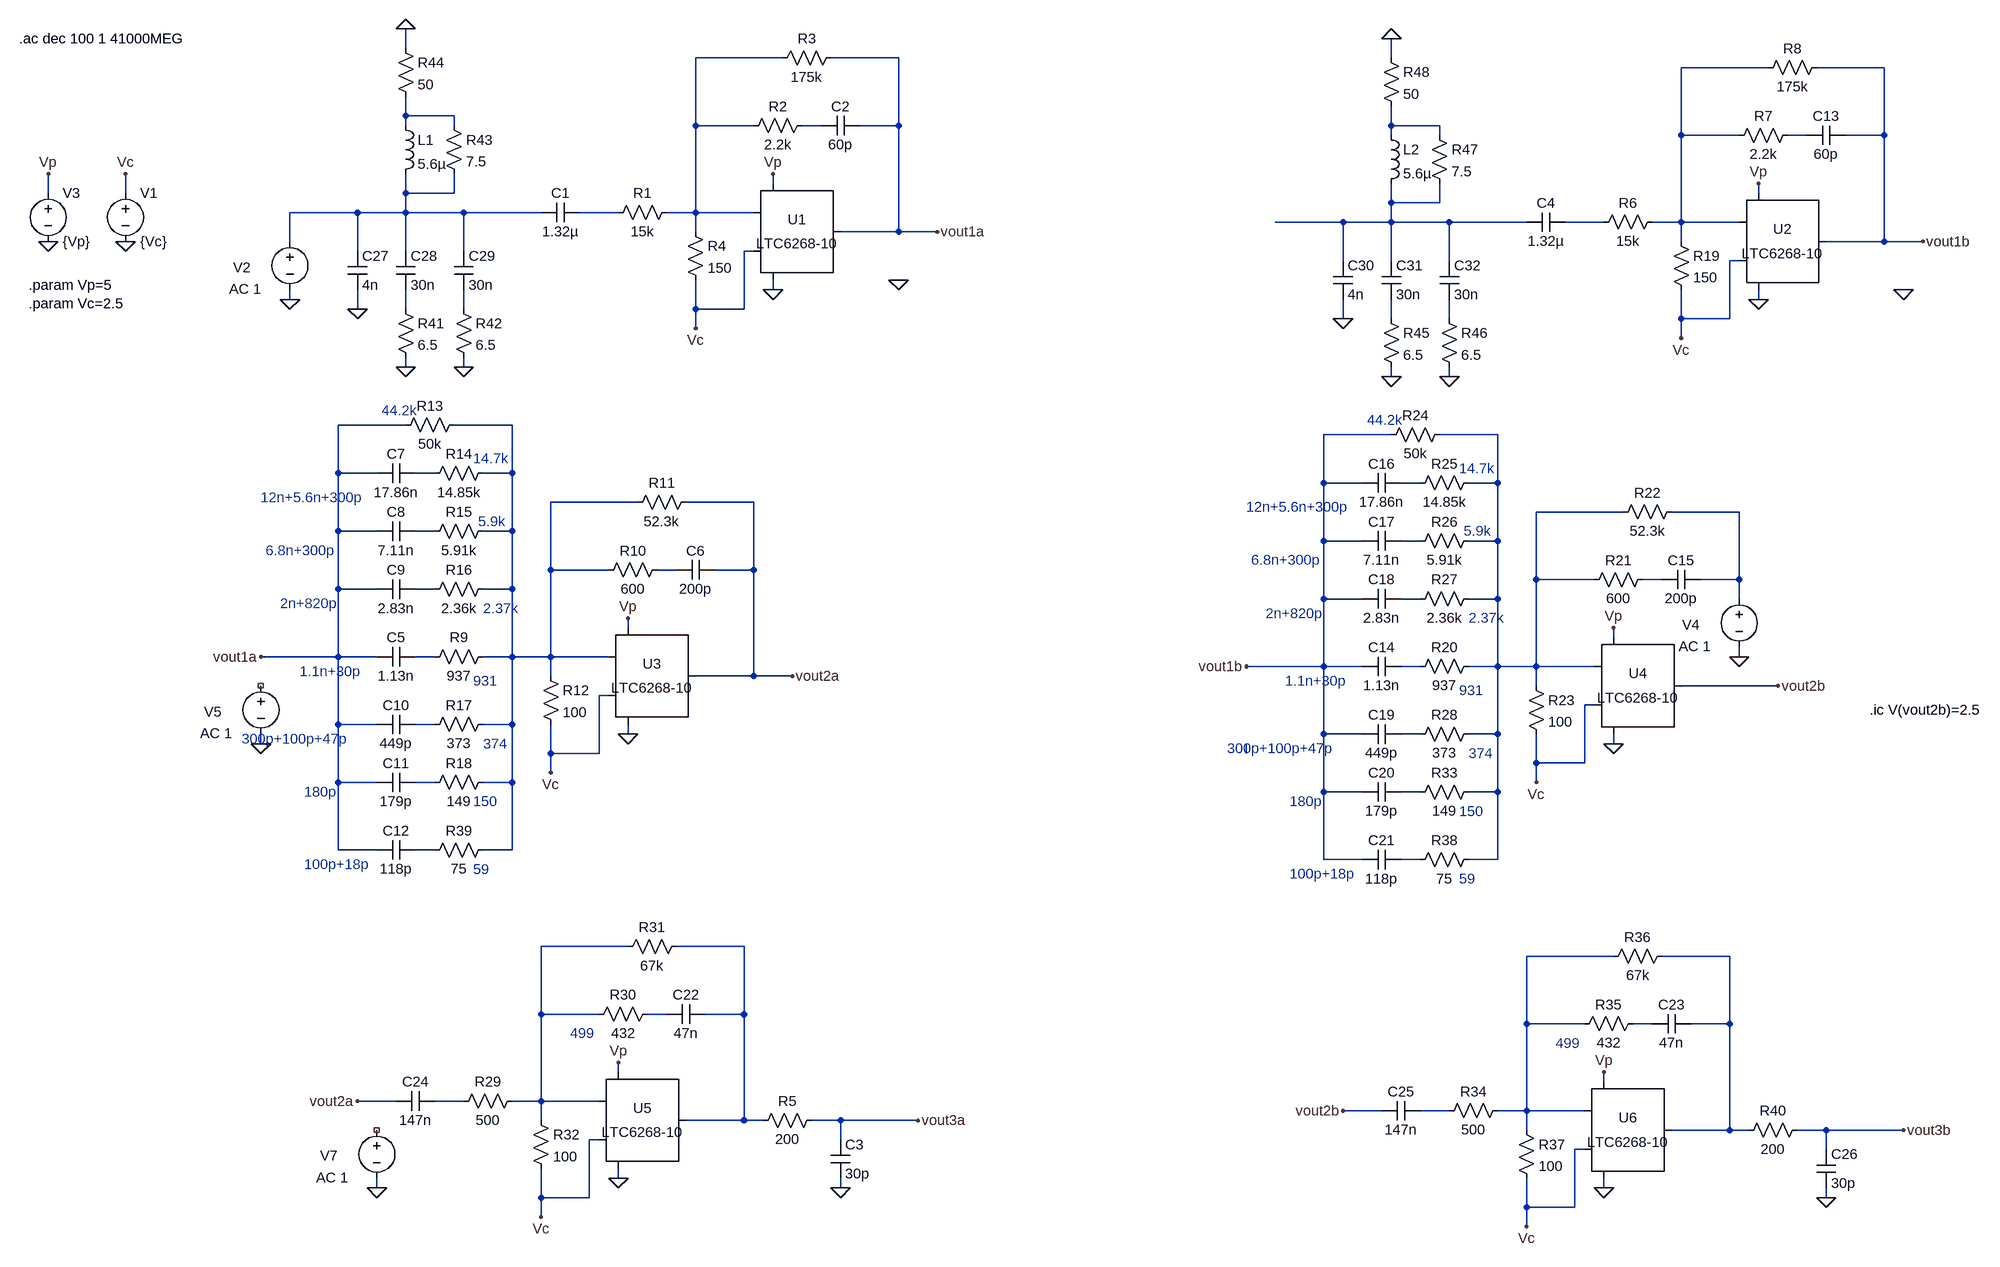
[diagram p0: schematic 3stagecompensator_localloopgainchecks_20210710.asc]
3stagecompensator_localloopgainchecks_20210710.asc, the LTspice schematic file:
Version 4
SHEET 1 2244 2536
WIRE -400 -240 -400 -272
WIRE 224 -224 80 -224
WIRE 416 -224 304 -224
WIRE 1232 -224 1232 -256
WIRE 1856 -208 1712 -208
WIRE 2048 -208 1936 -208
WIRE -400 -128 -400 -160
WIRE -320 -128 -400 -128
WIRE -400 -112 -400 -128
WIRE -320 -112 -320 -128
WIRE 80 -112 80 -224
WIRE 176 -112 80 -112
WIRE 288 -112 256 -112
WIRE 416 -112 416 -224
WIRE 416 -112 352 -112
WIRE 1232 -112 1232 -144
WIRE 1312 -112 1232 -112
WIRE 1232 -96 1232 -112
WIRE 1312 -96 1312 -112
WIRE 1712 -96 1712 -208
WIRE 1808 -96 1712 -96
WIRE 1920 -96 1888 -96
WIRE 2048 -96 2048 -208
WIRE 2048 -96 1984 -96
WIRE 208 -16 208 -32
WIRE -992 0 -992 -32
WIRE -864 0 -864 -32
WIRE -400 0 -400 -32
WIRE -320 0 -320 -32
WIRE -320 0 -400 0
WIRE 1840 0 1840 -16
WIRE 1232 16 1232 -16
WIRE 1312 16 1312 -16
WIRE 1312 16 1232 16
WIRE -480 32 -592 32
WIRE -400 32 -400 0
WIRE -400 32 -480 32
WIRE -304 32 -400 32
WIRE -176 32 -304 32
WIRE -48 32 -112 32
WIRE 80 32 80 -112
WIRE 80 32 32 32
WIRE 176 32 80 32
WIRE 1152 48 1040 48
WIRE 1232 48 1232 16
WIRE 1232 48 1152 48
WIRE 1328 48 1232 48
WIRE 1456 48 1328 48
WIRE 1584 48 1520 48
WIRE 1712 48 1712 -96
WIRE 1712 48 1664 48
WIRE 1808 48 1712 48
WIRE 80 64 80 32
WIRE 416 64 416 -112
WIRE 416 64 320 64
WIRE 480 64 416 64
WIRE -592 80 -592 32
WIRE 1712 80 1712 48
WIRE 2048 80 2048 -96
WIRE 2048 80 1952 80
WIRE 2112 80 2048 80
WIRE -480 96 -480 32
WIRE -400 96 -400 32
WIRE -304 96 -304 32
WIRE 176 96 160 96
WIRE 1152 112 1152 48
WIRE 1232 112 1232 48
WIRE 1328 112 1328 48
WIRE 1808 112 1792 112
WIRE 208 160 208 144
WIRE -592 176 -592 160
WIRE 1840 176 1840 160
WIRE -480 192 -480 160
WIRE -400 192 -400 160
WIRE -304 192 -304 160
WIRE 80 192 80 144
WIRE 160 192 160 96
WIRE 160 192 80 192
WIRE 1152 208 1152 176
WIRE 1232 208 1232 176
WIRE 1328 208 1328 176
WIRE 1712 208 1712 160
WIRE 1792 208 1792 112
WIRE 1792 208 1712 208
WIRE 80 224 80 192
WIRE 1712 240 1712 208
WIRE -400 288 -400 272
WIRE -304 288 -304 272
WIRE 1232 304 1232 288
WIRE 1328 304 1328 288
WIRE -400 384 -512 384
WIRE -224 384 -320 384
WIRE 1232 400 1120 400
WIRE 1408 400 1312 400
WIRE -512 464 -512 384
WIRE -448 464 -512 464
WIRE -352 464 -384 464
WIRE -224 464 -224 384
WIRE -224 464 -272 464
WIRE 1120 480 1120 400
WIRE 1184 480 1120 480
WIRE 1280 480 1248 480
WIRE 1408 480 1408 400
WIRE 1408 480 1360 480
WIRE -16 512 -160 512
WIRE 176 512 64 512
WIRE 1616 528 1472 528
WIRE 1808 528 1696 528
WIRE -512 560 -512 464
WIRE -448 560 -512 560
WIRE -352 560 -384 560
WIRE -224 560 -224 464
WIRE -224 560 -272 560
WIRE 1120 576 1120 480
WIRE 1184 576 1120 576
WIRE 1280 576 1248 576
WIRE 1408 576 1408 480
WIRE 1408 576 1360 576
WIRE -160 624 -160 512
WIRE -64 624 -160 624
WIRE 48 624 16 624
WIRE 176 624 176 512
WIRE 176 624 112 624
WIRE 1472 640 1472 528
WIRE 1568 640 1472 640
WIRE 1680 640 1648 640
WIRE 1808 640 1808 528
WIRE 1808 640 1744 640
WIRE -512 656 -512 560
WIRE -448 656 -512 656
WIRE -352 656 -384 656
WIRE -224 656 -224 560
WIRE -224 656 -272 656
WIRE 1120 672 1120 576
WIRE 1184 672 1120 672
WIRE 1280 672 1248 672
WIRE 1408 672 1408 576
WIRE 1408 672 1360 672
WIRE 1808 672 1808 640
WIRE -32 720 -32 704
WIRE 1600 736 1600 720
WIRE -512 768 -512 656
WIRE -512 768 -640 768
WIRE -448 768 -512 768
WIRE -352 768 -384 768
WIRE -224 768 -224 656
WIRE -224 768 -272 768
WIRE -160 768 -160 624
WIRE -160 768 -224 768
WIRE -64 768 -160 768
WIRE 1808 768 1808 752
WIRE 1120 784 1120 672
WIRE 1120 784 992 784
WIRE 1184 784 1120 784
WIRE 1280 784 1248 784
WIRE 1408 784 1408 672
WIRE 1408 784 1360 784
WIRE 1472 784 1472 640
WIRE 1472 784 1408 784
WIRE 1568 784 1472 784
WIRE -160 800 -160 768
WIRE 176 800 176 624
WIRE 176 800 80 800
WIRE 240 800 176 800
WIRE 1472 816 1472 784
WIRE 1872 816 1712 816
WIRE -64 832 -80 832
WIRE 1568 848 1552 848
WIRE -512 880 -512 768
WIRE -448 880 -512 880
WIRE -352 880 -384 880
WIRE -224 880 -224 768
WIRE -224 880 -272 880
WIRE -32 896 -32 880
WIRE 1120 896 1120 784
WIRE 1184 896 1120 896
WIRE 1280 896 1248 896
WIRE 1408 896 1408 784
WIRE 1408 896 1360 896
WIRE -640 912 -640 896
WIRE 1600 912 1600 896
WIRE -160 928 -160 880
WIRE -80 928 -80 832
WIRE -80 928 -160 928
WIRE 992 928 992 912
WIRE 1472 944 1472 896
WIRE 1552 944 1552 848
WIRE 1552 944 1472 944
WIRE -160 960 -160 928
WIRE -512 976 -512 880
WIRE -448 976 -512 976
WIRE -352 976 -384 976
WIRE -224 976 -224 880
WIRE -224 976 -272 976
WIRE 1472 976 1472 944
WIRE 1120 992 1120 896
WIRE 1184 992 1120 992
WIRE 1280 992 1248 992
WIRE 1408 992 1408 896
WIRE 1408 992 1360 992
WIRE -512 1088 -512 976
WIRE -448 1088 -512 1088
WIRE -352 1088 -384 1088
WIRE -224 1088 -224 976
WIRE -224 1088 -272 1088
WIRE 1120 1104 1120 992
WIRE 1184 1104 1120 1104
WIRE 1280 1104 1248 1104
WIRE 1408 1104 1408 992
WIRE 1408 1104 1360 1104
WIRE -32 1248 -176 1248
WIRE 160 1248 48 1248
WIRE 1600 1264 1456 1264
WIRE 1792 1264 1680 1264
WIRE -176 1360 -176 1248
WIRE -80 1360 -176 1360
WIRE 32 1360 0 1360
WIRE 160 1360 160 1248
WIRE 160 1360 96 1360
WIRE 1456 1376 1456 1264
WIRE 1552 1376 1456 1376
WIRE 1664 1376 1632 1376
WIRE 1792 1376 1792 1264
WIRE 1792 1376 1728 1376
WIRE -48 1456 -48 1440
WIRE 1584 1472 1584 1456
WIRE -416 1504 -480 1504
WIRE -304 1504 -352 1504
WIRE -176 1504 -176 1360
WIRE -176 1504 -224 1504
WIRE -80 1504 -176 1504
WIRE 1216 1520 1152 1520
WIRE 1328 1520 1280 1520
WIRE 1456 1520 1456 1376
WIRE 1456 1520 1408 1520
WIRE 1552 1520 1456 1520
WIRE -176 1536 -176 1504
WIRE 160 1536 160 1360
WIRE 160 1536 64 1536
WIRE 192 1536 160 1536
WIRE 320 1536 272 1536
WIRE 448 1536 320 1536
WIRE 1456 1552 1456 1520
WIRE 1792 1552 1792 1376
WIRE 1792 1552 1696 1552
WIRE 1824 1552 1792 1552
WIRE 1952 1552 1904 1552
WIRE 2080 1552 1952 1552
WIRE -80 1568 -96 1568
WIRE 320 1568 320 1536
WIRE 1552 1584 1536 1584
WIRE 1952 1584 1952 1552
WIRE -48 1632 -48 1616
WIRE -448 1648 -448 1632
WIRE 320 1648 320 1632
WIRE 1584 1648 1584 1632
WIRE -176 1664 -176 1616
WIRE -96 1664 -96 1568
WIRE -96 1664 -176 1664
WIRE 1952 1664 1952 1648
WIRE 1456 1680 1456 1632
WIRE 1536 1680 1536 1584
WIRE 1536 1680 1456 1680
WIRE -176 1696 -176 1664
WIRE 1456 1712 1456 1680
FLAG 208 160 0
FLAG -992 80 0
FLAG 480 64 vout1a
FLAG -992 -32 Vp
FLAG -864 80 0
FLAG -864 -32 Vc
FLAG 208 -32 Vp
FLAG -592 176 0
FLAG 80 224 Vc
FLAG -32 896 0
FLAG 240 800 vout2a
FLAG -32 704 Vp
FLAG -640 912 0
FLAG -160 960 Vc
FLAG -48 1632 0
FLAG 448 1536 vout3a
FLAG -48 1440 Vp
FLAG -448 1648 0
FLAG -176 1696 Vc
FLAG 320 1648 0
FLAG -304 288 0
FLAG -400 288 0
FLAG -480 192 0
FLAG -400 -272 0
FLAG -640 768 vout1a
FLAG -480 1504 vout2a
FLAG 1840 176 0
FLAG 2112 80 vout1b
FLAG 1840 -16 Vp
FLAG 1808 768 0
FLAG 1712 240 Vc
FLAG 1600 912 0
FLAG 1872 816 vout2b
FLAG 1600 720 Vp
FLAG 1472 976 Vc
FLAG 1584 1648 0
FLAG 2080 1552 vout3b
FLAG 1584 1456 Vp
FLAG 1456 1712 Vc
FLAG 1952 1664 0
FLAG 1328 304 0
FLAG 1232 304 0
FLAG 1152 208 0
FLAG 1232 -256 0
FLAG 992 784 vout1b
FLAG 1152 1520 vout2b
FLAG 2080 160 0
FLAG 416 144 0
SYMBOL Opamps\\LTC6268-10 208 64 R0
SYMATTR InstName U1
SYMBOL voltage -992 -16 R0
WINDOW 123 0 0 Left 2
WINDOW 39 0 0 Left 2
SYMATTR InstName V3
SYMATTR Value {Vp}
SYMBOL voltage -864 -16 R0
WINDOW 123 0 0 Left 2
WINDOW 39 0 0 Left 2
SYMATTR InstName V1
SYMATTR Value {Vc}
SYMBOL res -64 48 R270
WINDOW 0 32 56 VTop 2
WINDOW 3 0 56 VBottom 2
SYMATTR InstName R1
SYMATTR Value 15k
SYMBOL cap -112 16 R90
WINDOW 0 0 32 VBottom 2
WINDOW 3 32 32 VTop 2
SYMATTR InstName C1
SYMATTR Value 1.32µ
SYMBOL res 272 -128 R90
WINDOW 0 0 56 VBottom 2
WINDOW 3 32 56 VTop 2
SYMATTR InstName R2
SYMATTR Value 2.2k
SYMBOL res 320 -240 R90
WINDOW 0 0 56 VBottom 2
WINDOW 3 32 56 VTop 2
SYMATTR InstName R3
SYMATTR Value 175k
SYMBOL cap 352 -128 R90
WINDOW 0 0 32 VBottom 2
WINDOW 3 32 32 VTop 2
SYMATTR InstName C2
SYMATTR Value 60p
SYMBOL voltage -592 64 R0
WINDOW 0 -94 59 Left 2
WINDOW 123 -100 95 Left 2
WINDOW 39 0 0 Left 0
SYMATTR InstName V2
SYMATTR Value2 AC 1
SYMATTR Value ""
SYMBOL res 64 48 R0
SYMATTR InstName R4
SYMATTR Value 150
SYMBOL Opamps\\LTC6268-10 -32 800 R0
SYMATTR InstName U3
SYMBOL res -368 784 R270
WINDOW 0 32 56 VTop 2
WINDOW 3 0 56 VBottom 2
SYMATTR InstName R9
SYMATTR Value 937
SYMBOL cap -384 752 R90
WINDOW 0 0 32 VBottom 2
WINDOW 3 32 32 VTop 2
SYMATTR InstName C5
SYMATTR Value 1.13n
SYMBOL res 32 608 R90
WINDOW 0 0 56 VBottom 2
WINDOW 3 32 56 VTop 2
SYMATTR InstName R10
SYMATTR Value 600
SYMBOL res 80 496 R90
WINDOW 0 0 56 VBottom 2
WINDOW 3 32 56 VTop 2
SYMATTR InstName R11
SYMATTR Value 52.3k
SYMBOL cap 112 608 R90
WINDOW 0 0 32 VBottom 2
WINDOW 3 32 32 VTop 2
SYMATTR InstName C6
SYMATTR Value 200p
SYMBOL voltage -640 800 R0
WINDOW 0 -94 59 Left 2
WINDOW 123 -100 95 Left 2
WINDOW 39 0 0 Left 0
SYMATTR InstName V5
SYMATTR Value2 AC 1
SYMATTR Value ""
SYMBOL res -176 784 R0
SYMATTR InstName R12
SYMATTR Value 100
SYMBOL res -304 368 R90
WINDOW 0 0 56 VBottom 2
WINDOW 3 32 56 VTop 2
SYMATTR InstName R13
SYMATTR Value 50k
SYMBOL res -368 480 R270
WINDOW 0 32 56 VTop 2
WINDOW 3 0 56 VBottom 2
SYMATTR InstName R14
SYMATTR Value 14.85k
SYMBOL cap -384 448 R90
WINDOW 0 0 32 VBottom 2
WINDOW 3 32 32 VTop 2
SYMATTR InstName C7
SYMATTR Value 17.86n
SYMBOL res -368 576 R270
WINDOW 0 32 56 VTop 2
WINDOW 3 0 56 VBottom 2
SYMATTR InstName R15
SYMATTR Value 5.91k
SYMBOL cap -384 544 R90
WINDOW 0 0 32 VBottom 2
WINDOW 3 32 32 VTop 2
SYMATTR InstName C8
SYMATTR Value 7.11n
SYMBOL res -368 672 R270
WINDOW 0 32 56 VTop 2
WINDOW 3 0 56 VBottom 2
SYMATTR InstName R16
SYMATTR Value 2.36k
SYMBOL cap -384 640 R90
WINDOW 0 0 32 VBottom 2
WINDOW 3 32 32 VTop 2
SYMATTR InstName C9
SYMATTR Value 2.83n
SYMBOL res -368 896 R270
WINDOW 0 32 56 VTop 2
WINDOW 3 0 56 VBottom 2
SYMATTR InstName R17
SYMATTR Value 373
SYMBOL cap -384 864 R90
WINDOW 0 0 32 VBottom 2
WINDOW 3 32 32 VTop 2
SYMATTR InstName C10
SYMATTR Value 449p
SYMBOL res -368 992 R270
WINDOW 0 32 56 VTop 2
WINDOW 3 0 56 VBottom 2
SYMATTR InstName R18
SYMATTR Value 149
SYMBOL cap -384 960 R90
WINDOW 0 0 32 VBottom 2
WINDOW 3 32 32 VTop 2
SYMATTR InstName C11
SYMATTR Value 179p
SYMBOL cap -384 1072 R90
WINDOW 0 0 32 VBottom 2
WINDOW 3 32 32 VTop 2
SYMATTR InstName C12
SYMATTR Value 118p
SYMBOL Opamps\\LTC6268-10 -48 1536 R0
SYMATTR InstName U5
SYMBOL res -320 1520 R270
WINDOW 0 32 56 VTop 2
WINDOW 3 0 56 VBottom 2
SYMATTR InstName R29
SYMATTR Value 500
SYMBOL res 16 1344 R90
WINDOW 0 0 56 VBottom 2
WINDOW 3 32 56 VTop 2
SYMATTR InstName R30
SYMATTR Value 432
SYMBOL res 64 1232 R90
WINDOW 0 0 56 VBottom 2
WINDOW 3 32 56 VTop 2
SYMATTR InstName R31
SYMATTR Value 67k
SYMBOL cap 96 1344 R90
WINDOW 0 0 32 VBottom 2
WINDOW 3 32 32 VTop 2
SYMATTR InstName C22
SYMATTR Value 47n
SYMBOL voltage -448 1536 R0
WINDOW 0 -94 59 Left 2
WINDOW 123 -100 95 Left 2
WINDOW 39 0 0 Left 0
SYMATTR InstName V7
SYMATTR Value2 AC 1
SYMATTR Value ""
SYMBOL res -192 1520 R0
SYMATTR InstName R32
SYMATTR Value 100
SYMBOL res -368 1104 R270
WINDOW 0 32 56 VTop 2
WINDOW 3 0 56 VBottom 2
SYMATTR InstName R39
SYMATTR Value 75
SYMBOL cap -352 1488 R90
WINDOW 0 0 32 VBottom 2
WINDOW 3 32 32 VTop 2
SYMATTR InstName C24
SYMATTR Value 147n
SYMBOL res 288 1520 R90
WINDOW 0 0 56 VBottom 2
WINDOW 3 32 56 VTop 2
SYMATTR InstName R5
SYMATTR Value 200
SYMBOL cap 304 1568 R0
SYMATTR InstName C3
SYMATTR Value 30p
SYMBOL cap -496 96 R0
SYMATTR InstName C27
SYMATTR Value 4n
SYMBOL cap -416 96 R0
SYMATTR InstName C28
SYMATTR Value 30n
SYMBOL res -416 176 R0
SYMATTR InstName R41
SYMATTR Value 6.5
SYMBOL cap -320 96 R0
SYMATTR InstName C29
SYMATTR Value 30n
SYMBOL res -320 176 R0
SYMATTR InstName R42
SYMATTR Value 6.5
SYMBOL ind -416 -128 R0
SYMATTR InstName L1
SYMATTR Value 5.6µ
SYMBOL res -336 -128 R0
SYMATTR InstName R43
SYMATTR Value 7.5
SYMBOL res -416 -256 R0
SYMATTR InstName R44
SYMATTR Value 50
SYMBOL Opamps\\LTC6268-10 1840 80 R0
SYMATTR InstName U2
SYMBOL res 1568 64 R270
WINDOW 0 32 56 VTop 2
WINDOW 3 0 56 VBottom 2
SYMATTR InstName R6
SYMATTR Value 15k
SYMBOL cap 1520 32 R90
WINDOW 0 0 32 VBottom 2
WINDOW 3 32 32 VTop 2
SYMATTR InstName C4
SYMATTR Value 1.32µ
SYMBOL res 1904 -112 R90
WINDOW 0 0 56 VBottom 2
WINDOW 3 32 56 VTop 2
SYMATTR InstName R7
SYMATTR Value 2.2k
SYMBOL res 1952 -224 R90
WINDOW 0 0 56 VBottom 2
WINDOW 3 32 56 VTop 2
SYMATTR InstName R8
SYMATTR Value 175k
SYMBOL cap 1984 -112 R90
WINDOW 0 0 32 VBottom 2
WINDOW 3 32 32 VTop 2
SYMATTR InstName C13
SYMATTR Value 60p
SYMBOL voltage 1808 656 R0
WINDOW 0 -94 59 Left 2
WINDOW 123 -100 95 Left 2
WINDOW 39 0 0 Left 0
SYMATTR InstName V4
SYMATTR Value2 AC 1
SYMATTR Value ""
SYMBOL res 1696 64 R0
SYMATTR InstName R19
SYMATTR Value 150
SYMBOL Opamps\\LTC6268-10 1600 816 R0
SYMATTR InstName U4
SYMBOL res 1264 800 R270
WINDOW 0 32 56 VTop 2
WINDOW 3 0 56 VBottom 2
SYMATTR InstName R20
SYMATTR Value 937
SYMBOL cap 1248 768 R90
WINDOW 0 0 32 VBottom 2
WINDOW 3 32 32 VTop 2
SYMATTR InstName C14
SYMATTR Value 1.13n
SYMBOL res 1664 624 R90
WINDOW 0 0 56 VBottom 2
WINDOW 3 32 56 VTop 2
SYMATTR InstName R21
SYMATTR Value 600
SYMBOL res 1712 512 R90
WINDOW 0 0 56 VBottom 2
WINDOW 3 32 56 VTop 2
SYMATTR InstName R22
SYMATTR Value 52.3k
SYMBOL cap 1744 624 R90
WINDOW 0 0 32 VBottom 2
WINDOW 3 32 32 VTop 2
SYMATTR InstName C15
SYMATTR Value 200p
SYMBOL res 1456 800 R0
SYMATTR InstName R23
SYMATTR Value 100
SYMBOL res 1328 384 R90
WINDOW 0 0 56 VBottom 2
WINDOW 3 32 56 VTop 2
SYMATTR InstName R24
SYMATTR Value 50k
SYMBOL res 1264 496 R270
WINDOW 0 32 56 VTop 2
WINDOW 3 0 56 VBottom 2
SYMATTR InstName R25
SYMATTR Value 14.85k
SYMBOL cap 1248 464 R90
WINDOW 0 0 32 VBottom 2
WINDOW 3 32 32 VTop 2
SYMATTR InstName C16
SYMATTR Value 17.86n
SYMBOL res 1264 592 R270
WINDOW 0 32 56 VTop 2
WINDOW 3 0 56 VBottom 2
SYMATTR InstName R26
SYMATTR Value 5.91k
SYMBOL cap 1248 560 R90
WINDOW 0 0 32 VBottom 2
WINDOW 3 32 32 VTop 2
SYMATTR InstName C17
SYMATTR Value 7.11n
SYMBOL res 1264 688 R270
WINDOW 0 32 56 VTop 2
WINDOW 3 0 56 VBottom 2
SYMATTR InstName R27
SYMATTR Value 2.36k
SYMBOL cap 1248 656 R90
WINDOW 0 0 32 VBottom 2
WINDOW 3 32 32 VTop 2
SYMATTR InstName C18
SYMATTR Value 2.83n
SYMBOL res 1264 912 R270
WINDOW 0 32 56 VTop 2
WINDOW 3 0 56 VBottom 2
SYMATTR InstName R28
SYMATTR Value 373
SYMBOL cap 1248 880 R90
WINDOW 0 0 32 VBottom 2
WINDOW 3 32 32 VTop 2
SYMATTR InstName C19
SYMATTR Value 449p
SYMBOL res 1264 1008 R270
WINDOW 0 32 56 VTop 2
WINDOW 3 0 56 VBottom 2
SYMATTR InstName R33
SYMATTR Value 149
SYMBOL cap 1248 976 R90
WINDOW 0 0 32 VBottom 2
WINDOW 3 32 32 VTop 2
SYMATTR InstName C20
SYMATTR Value 179p
SYMBOL cap 1248 1088 R90
WINDOW 0 0 32 VBottom 2
WINDOW 3 32 32 VTop 2
SYMATTR InstName C21
SYMATTR Value 118p
SYMBOL Opamps\\LTC6268-10 1584 1552 R0
SYMATTR InstName U6
SYMBOL res 1312 1536 R270
WINDOW 0 32 56 VTop 2
WINDOW 3 0 56 VBottom 2
SYMATTR InstName R34
SYMATTR Value 500
SYMBOL res 1648 1360 R90
WINDOW 0 0 56 VBottom 2
WINDOW 3 32 56 VTop 2
SYMATTR InstName R35
SYMATTR Value 432
SYMBOL res 1696 1248 R90
WINDOW 0 0 56 VBottom 2
WINDOW 3 32 56 VTop 2
SYMATTR InstName R36
SYMATTR Value 67k
SYMBOL cap 1728 1360 R90
WINDOW 0 0 32 VBottom 2
WINDOW 3 32 32 VTop 2
SYMATTR InstName C23
SYMATTR Value 47n
SYMBOL res 1440 1536 R0
SYMATTR InstName R37
SYMATTR Value 100
SYMBOL res 1264 1120 R270
WINDOW 0 32 56 VTop 2
WINDOW 3 0 56 VBottom 2
SYMATTR InstName R38
SYMATTR Value 75
SYMBOL cap 1280 1504 R90
WINDOW 0 0 32 VBottom 2
WINDOW 3 32 32 VTop 2
SYMATTR InstName C25
SYMATTR Value 147n
SYMBOL res 1920 1536 R90
WINDOW 0 0 56 VBottom 2
WINDOW 3 32 56 VTop 2
SYMATTR InstName R40
SYMATTR Value 200
SYMBOL cap 1936 1584 R0
SYMATTR InstName C26
SYMATTR Value 30p
SYMBOL cap 1136 112 R0
SYMATTR InstName C30
SYMATTR Value 4n
SYMBOL cap 1216 112 R0
SYMATTR InstName C31
SYMATTR Value 30n
SYMBOL res 1216 192 R0
SYMATTR InstName R45
SYMATTR Value 6.5
SYMBOL cap 1312 112 R0
SYMATTR InstName C32
SYMATTR Value 30n
SYMBOL res 1312 192 R0
SYMATTR InstName R46
SYMATTR Value 6.5
SYMBOL ind 1216 -112 R0
SYMATTR InstName L2
SYMATTR Value 5.6µ
SYMBOL res 1296 -112 R0
SYMATTR InstName R47
SYMATTR Value 7.5
SYMBOL res 1216 -240 R0
SYMATTR InstName R48
SYMATTR Value 50
TEXT -1040 -256 Left 2 !.ac dec 100 1 41000MEG
TEXT -1024 152 Left 2 !.param Vp=5\n.param Vc=2.5
TEXT 2024 856 Left 2 !.ic V(vout2b)=2.5
TEXT -440 360 Left 2 ;44.2k
TEXT -288 440 Left 2 ;14.7k
TEXT -280 544 Left 2 ;5.9k
TEXT -272 688 Left 2 ;2.37k
TEXT -288 808 Left 2 ;931
TEXT -272 912 Left 2 ;374
TEXT -288 1008 Left 2 ;150
TEXT -288 1120 Left 2 ;59
TEXT -640 504 Left 2 ;12n+5.6n+300p
TEXT -632 592 Left 2 ;6.8n+300p
TEXT -608 680 Left 2 ;2n+820p
TEXT -576 792 Left 2 ;1.1n+30p
TEXT -672 904 Left 2 ;300p+100p+47p
TEXT -568 992 Left 2 ;180p
TEXT -568 1112 Left 2 ;100p+18p
TEXT -128 1392 Left 2 ;499
TEXT 1192 376 Left 2 ;44.2k
TEXT 1344 456 Left 2 ;14.7k
TEXT 1352 560 Left 2 ;5.9k
TEXT 1360 704 Left 2 ;2.37k
TEXT 1344 824 Left 2 ;931
TEXT 1360 928 Left 2 ;374
TEXT 1344 1024 Left 2 ;150
TEXT 1344 1136 Left 2 ;59
TEXT 992 520 Left 2 ;12n+5.6n+300p
TEXT 1000 608 Left 2 ;6.8n+300p
TEXT 1024 696 Left 2 ;2n+820p
TEXT 1056 808 Left 2 ;1.1n+30p
TEXT 960 920 Left 2 ;300p+100p+47p
TEXT 1064 1008 Left 2 ;180p
TEXT 1064 1128 Left 2 ;100p+18p
TEXT 1504 1408 Left 2 ;499

The netlist it stands for:
* 3stagecompensator_localloopgainchecks_20210710.asc
XU1 Vc N001 vout1a Vp 0 NC_01 LTC6268-10
V3 Vp 0 {Vp}
V1 Vc 0 {Vc}
R1 N009 N001 15k
C1 N009 N007 1.32µ
R2 N004 N001 2.2k
R3 vout1a N001 175k
C2 vout1a N004 60p
V2 N007 0 AC 1
R4 N001 Vc 150
XU3 Vc N015 vout2a Vp 0 NC_02 LTC6268-10
R9 N026 N015 937
C5 N026 vout1a 1.13n
R10 N022 N015 600
R11 vout2a N015 52.3k
C6 vout2a N022 200p
V5 NC_03 0 AC 1
R12 N015 Vc 100
R13 N015 vout1a 50k
R14 N017 N015 14.85k
C7 N017 vout1a 17.86n
R15 N020 N015 5.91k
C8 N020 vout1a 7.11n
R16 N024 N015 2.36k
C9 N024 vout1a 2.83n
R17 N028 N015 373
C10 N028 vout1a 449p
R18 N031 N015 149
C11 N031 vout1a 179p
C12 N033 vout1a 118p
XU5 Vc N035 N036 Vp 0 NC_04 LTC6268-10
R29 N041 N035 500
R30 N039 N035 432
R31 N036 N035 67k
C22 N036 N039 47n
V7 NC_05 0 AC 1
R32 N035 Vc 100
R39 N033 N015 75
C24 N041 vout2a 147n
R5 vout3a N036 200
C3 vout3a 0 30p
C27 N007 0 4n
C28 N007 N011 30n
R41 N011 0 6.5
C29 N007 N012 30n
R42 N012 0 6.5
L1 N003 N007 5.6µ
R43 N003 N007 7.5
R44 0 N003 50
XU2 Vc N002 vout1b Vp 0 NC_06 LTC6268-10
R6 N010 N002 15k
C4 N010 N008 1.32µ
R7 N006 N002 2.2k
R8 vout1b N002 175k
C13 vout1b N006 60p
V4 N019 0 AC 1
R19 N002 Vc 150
XU4 Vc N016 vout2b Vp 0 NC_07 LTC6268-10
R20 N027 N016 937
C14 N027 vout1b 1.13n
R21 N023 N016 600
R22 N019 N016 52.3k
C15 N019 N023 200p
R23 N016 Vc 100
R24 N016 vout1b 50k
R25 N018 N016 14.85k
C16 N018 vout1b 17.86n
R26 N021 N016 5.91k
C17 N021 vout1b 7.11n
R27 N025 N016 2.36k
C18 N025 vout1b 2.83n
R28 N029 N016 373
C19 N029 vout1b 449p
R33 N032 N016 149
C20 N032 vout1b 179p
C21 N034 vout1b 118p
XU6 Vc N037 N038 Vp 0 NC_08 LTC6268-10
R34 N042 N037 500
R35 N040 N037 432
R36 N038 N037 67k
C23 N038 N040 47n
R37 N037 Vc 100
R38 N034 N016 75
C25 N042 vout2b 147n
R40 vout3b N038 200
C26 vout3b 0 30p
C30 N008 0 4n
C31 N008 N013 30n
R45 N013 0 6.5
C32 N008 N014 30n
R46 N014 0 6.5
L2 N005 N008 5.6µ
R47 N005 N008 7.5
R48 0 N005 50
.ac dec 100 1 41000MEG
.param Vp=5
.param Vc=2.5
.ic V(vout2b)=2.5
* 44.2k
* 14.7k
* 5.9k
* 2.37k
* 931
* 374
* 150
* 59
* 12n+5.6n+300p
* 6.8n+300p
* 2n+820p
* 1.1n+30p
* 300p+100p+47p
* 180p
* 100p+18p
* 499
* 44.2k
* 14.7k
* 5.9k
* 2.37k
* 931
* 374
* 150
* 59
* 12n+5.6n+300p
* 6.8n+300p
* 2n+820p
* 1.1n+30p
* 300p+100p+47p
* 180p
* 100p+18p
* 499
.lib LTC2.lib
.backanno
.end